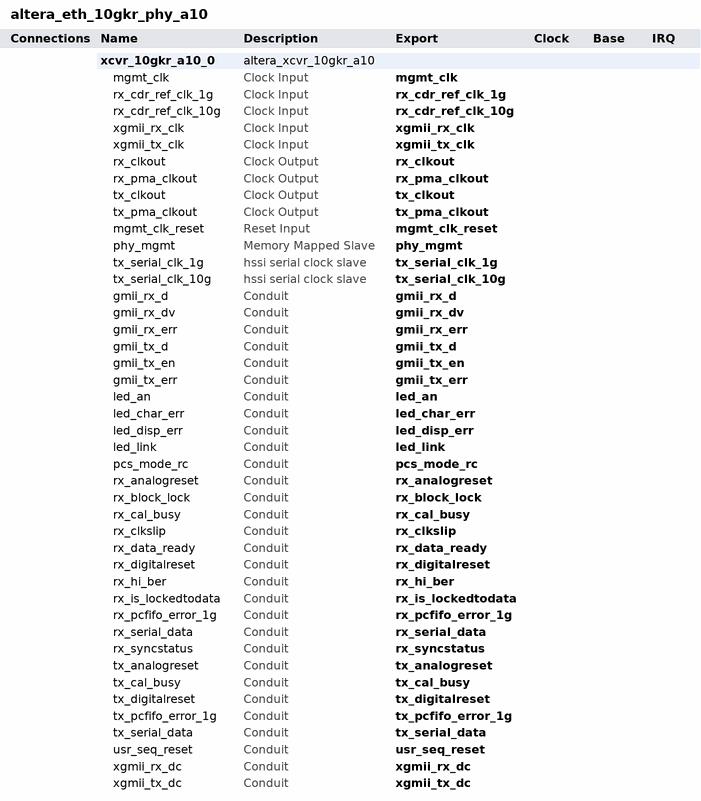
[diagram p0: system contents]
# Platform Designer (Qsys) system altera_eth_10gkr_phy_a10, Arria 10 10AX115S4F45I3SGE2
# Parameters at their usual value, and those the tool derives, are not listed.
package require -exact qsys 16.0
create_system altera_eth_10gkr_phy_a10
set_project_property DEVICE_FAMILY {Arria 10}
set_project_property DEVICE 10AX115S4F45I3SGE2

add_instance xcvr_10gkr_a10_0 altera_xcvr_10gkr_a10 16.0
set_instance_property xcvr_10gkr_a10_0 AUTO_EXPORT true
set_instance_parameter_value xcvr_10gkr_a10_0 AN_100G 0
set_instance_parameter_value xcvr_10gkr_a10_0 AN_40GBP 0
set_instance_parameter_value xcvr_10gkr_a10_0 AN_40GCR 0
set_instance_parameter_value xcvr_10gkr_a10_0 AN_BASER 1
set_instance_parameter_value xcvr_10gkr_a10_0 AN_FEC 0
set_instance_parameter_value xcvr_10gkr_a10_0 AN_PAUSE_C0 1
set_instance_parameter_value xcvr_10gkr_a10_0 AN_PAUSE_C1 1
set_instance_parameter_value xcvr_10gkr_a10_0 AN_SELECTOR 1
set_instance_parameter_value xcvr_10gkr_a10_0 AN_XAUI 0
set_instance_parameter_value xcvr_10gkr_a10_0 BERWIDTH_gui 511
set_instance_parameter_value xcvr_10gkr_a10_0 CAPABLE_FEC 1
set_instance_parameter_value xcvr_10gkr_a10_0 DEV_VERSION 0
set_instance_parameter_value xcvr_10gkr_a10_0 ENABLE_FEC 1
set_instance_parameter_value xcvr_10gkr_a10_0 ENABLE_PCS_MODE 1
set_instance_parameter_value xcvr_10gkr_a10_0 EN_CORECLK_1G 0
set_instance_parameter_value xcvr_10gkr_a10_0 ERR_INDICATION 1
set_instance_parameter_value xcvr_10gkr_a10_0 GOOD_PARITY 4
set_instance_parameter_value xcvr_10gkr_a10_0 HARD_PRBS_ENABLE 0
set_instance_parameter_value xcvr_10gkr_a10_0 HARD_PRBS_ENABLE_PORT 0
set_instance_parameter_value xcvr_10gkr_a10_0 INITMAINVAL 25
set_instance_parameter_value xcvr_10gkr_a10_0 INITPOSTVAL 22
set_instance_parameter_value xcvr_10gkr_a10_0 INITPREVAL 3
set_instance_parameter_value xcvr_10gkr_a10_0 INI_DATAPATH 10G
set_instance_parameter_value xcvr_10gkr_a10_0 INVALD_PARITY 8
set_instance_parameter_value xcvr_10gkr_a10_0 LINK_TIMER_KR 504.00
set_instance_parameter_value xcvr_10gkr_a10_0 LINK_TIMER_KX 48.00
set_instance_parameter_value xcvr_10gkr_a10_0 OPTIONAL_10G 1
set_instance_parameter_value xcvr_10gkr_a10_0 OPTIONAL_FEC 0
set_instance_parameter_value xcvr_10gkr_a10_0 OPTIONAL_RXPMA_CLK 1
set_instance_parameter_value xcvr_10gkr_a10_0 OPTIONAL_RX_CLKOUT 1
set_instance_parameter_value xcvr_10gkr_a10_0 OPTIONAL_RX_DIV33CLK 0
set_instance_parameter_value xcvr_10gkr_a10_0 OPTIONAL_TXPMA_CLK 1
set_instance_parameter_value xcvr_10gkr_a10_0 OPTIONAL_TX_CLKOUT 1
set_instance_parameter_value xcvr_10gkr_a10_0 OPTIONAL_TX_DIV33CLK 0
set_instance_parameter_value xcvr_10gkr_a10_0 PHY_IDENTIFIER 0
set_instance_parameter_value xcvr_10gkr_a10_0 PREMAINVAL 30
set_instance_parameter_value xcvr_10gkr_a10_0 PREPOSTVAL 0
set_instance_parameter_value xcvr_10gkr_a10_0 PREPREVAL 0
set_instance_parameter_value xcvr_10gkr_a10_0 REF_CLK_FREQ_10G 644.53125
set_instance_parameter_value xcvr_10gkr_a10_0 REF_CLK_FREQ_1G {125.00 MHz}
set_instance_parameter_value xcvr_10gkr_a10_0 SYNTH_1588_ALL 0
set_instance_parameter_value xcvr_10gkr_a10_0 SYNTH_AN 0
set_instance_parameter_value xcvr_10gkr_a10_0 SYNTH_FEC 0
set_instance_parameter_value xcvr_10gkr_a10_0 SYNTH_GIGE 1
set_instance_parameter_value xcvr_10gkr_a10_0 SYNTH_GMII_gui 1
set_instance_parameter_value xcvr_10gkr_a10_0 SYNTH_LT 0
set_instance_parameter_value xcvr_10gkr_a10_0 SYNTH_MII 0
set_instance_parameter_value xcvr_10gkr_a10_0 SYNTH_RCFG 1
set_instance_parameter_value xcvr_10gkr_a10_0 SYNTH_SEQ 1
set_instance_parameter_value xcvr_10gkr_a10_0 SYNTH_SGMII 1
set_instance_parameter_value xcvr_10gkr_a10_0 TRNWTWIDTH_gui 127
set_instance_parameter_value xcvr_10gkr_a10_0 USE_DEBUG_CPU 0
set_instance_parameter_value xcvr_10gkr_a10_0 USE_ECC_CPU 0
set_instance_parameter_value xcvr_10gkr_a10_0 VMAXRULE 30
set_instance_parameter_value xcvr_10gkr_a10_0 VMINRULE 6
set_instance_parameter_value xcvr_10gkr_a10_0 VODMINRULE 14
set_instance_parameter_value xcvr_10gkr_a10_0 VPOSTRULE 25
set_instance_parameter_value xcvr_10gkr_a10_0 VPRERULE 16
set_instance_parameter_value xcvr_10gkr_a10_0 XGMII_32BIT_MODE 0
set_instance_parameter_value xcvr_10gkr_a10_0 phy_mgmt_clk_freq 125
set_instance_parameter_value xcvr_10gkr_a10_0 sel_backplane_lineside {1Gb/10Gb Ethernet}

# exported interfaces
add_interface gmii_rx_d conduit end
set_interface_property gmii_rx_d EXPORT_OF xcvr_10gkr_a10_0.gmii_rx_d
add_interface gmii_rx_dv conduit end
set_interface_property gmii_rx_dv EXPORT_OF xcvr_10gkr_a10_0.gmii_rx_dv
add_interface gmii_rx_err conduit end
set_interface_property gmii_rx_err EXPORT_OF xcvr_10gkr_a10_0.gmii_rx_err
add_interface gmii_tx_d conduit end
set_interface_property gmii_tx_d EXPORT_OF xcvr_10gkr_a10_0.gmii_tx_d
add_interface gmii_tx_en conduit end
set_interface_property gmii_tx_en EXPORT_OF xcvr_10gkr_a10_0.gmii_tx_en
add_interface gmii_tx_err conduit end
set_interface_property gmii_tx_err EXPORT_OF xcvr_10gkr_a10_0.gmii_tx_err
add_interface led_an conduit end
set_interface_property led_an EXPORT_OF xcvr_10gkr_a10_0.led_an
add_interface led_char_err conduit end
set_interface_property led_char_err EXPORT_OF xcvr_10gkr_a10_0.led_char_err
add_interface led_disp_err conduit end
set_interface_property led_disp_err EXPORT_OF xcvr_10gkr_a10_0.led_disp_err
add_interface led_link conduit end
set_interface_property led_link EXPORT_OF xcvr_10gkr_a10_0.led_link
add_interface mgmt_clk clock sink
set_interface_property mgmt_clk EXPORT_OF xcvr_10gkr_a10_0.mgmt_clk
add_interface mgmt_clk_reset reset sink
set_interface_property mgmt_clk_reset EXPORT_OF xcvr_10gkr_a10_0.mgmt_clk_reset
add_interface pcs_mode_rc conduit end
set_interface_property pcs_mode_rc EXPORT_OF xcvr_10gkr_a10_0.pcs_mode_rc
add_interface phy_mgmt avalon slave
set_interface_property phy_mgmt EXPORT_OF xcvr_10gkr_a10_0.phy_mgmt
add_interface rx_analogreset conduit end
set_interface_property rx_analogreset EXPORT_OF xcvr_10gkr_a10_0.rx_analogreset
add_interface rx_block_lock conduit end
set_interface_property rx_block_lock EXPORT_OF xcvr_10gkr_a10_0.rx_block_lock
add_interface rx_cal_busy conduit end
set_interface_property rx_cal_busy EXPORT_OF xcvr_10gkr_a10_0.rx_cal_busy
add_interface rx_cdr_ref_clk_10g clock sink
set_interface_property rx_cdr_ref_clk_10g EXPORT_OF xcvr_10gkr_a10_0.rx_cdr_ref_clk_10g
add_interface rx_cdr_ref_clk_1g clock sink
set_interface_property rx_cdr_ref_clk_1g EXPORT_OF xcvr_10gkr_a10_0.rx_cdr_ref_clk_1g
add_interface rx_clkout clock source
set_interface_property rx_clkout EXPORT_OF xcvr_10gkr_a10_0.rx_clkout
add_interface rx_clkslip conduit end
set_interface_property rx_clkslip EXPORT_OF xcvr_10gkr_a10_0.rx_clkslip
add_interface rx_data_ready conduit end
set_interface_property rx_data_ready EXPORT_OF xcvr_10gkr_a10_0.rx_data_ready
add_interface rx_digitalreset conduit end
set_interface_property rx_digitalreset EXPORT_OF xcvr_10gkr_a10_0.rx_digitalreset
add_interface rx_hi_ber conduit end
set_interface_property rx_hi_ber EXPORT_OF xcvr_10gkr_a10_0.rx_hi_ber
add_interface rx_is_lockedtodata conduit end
set_interface_property rx_is_lockedtodata EXPORT_OF xcvr_10gkr_a10_0.rx_is_lockedtodata
add_interface rx_pcfifo_error_1g conduit end
set_interface_property rx_pcfifo_error_1g EXPORT_OF xcvr_10gkr_a10_0.rx_pcfifo_error_1g
add_interface rx_pma_clkout clock source
set_interface_property rx_pma_clkout EXPORT_OF xcvr_10gkr_a10_0.rx_pma_clkout
add_interface rx_serial_data conduit end
set_interface_property rx_serial_data EXPORT_OF xcvr_10gkr_a10_0.rx_serial_data
add_interface rx_syncstatus conduit end
set_interface_property rx_syncstatus EXPORT_OF xcvr_10gkr_a10_0.rx_syncstatus
add_interface tx_analogreset conduit end
set_interface_property tx_analogreset EXPORT_OF xcvr_10gkr_a10_0.tx_analogreset
add_interface tx_cal_busy conduit end
set_interface_property tx_cal_busy EXPORT_OF xcvr_10gkr_a10_0.tx_cal_busy
add_interface tx_clkout clock source
set_interface_property tx_clkout EXPORT_OF xcvr_10gkr_a10_0.tx_clkout
add_interface tx_digitalreset conduit end
set_interface_property tx_digitalreset EXPORT_OF xcvr_10gkr_a10_0.tx_digitalreset
add_interface tx_pcfifo_error_1g conduit end
set_interface_property tx_pcfifo_error_1g EXPORT_OF xcvr_10gkr_a10_0.tx_pcfifo_error_1g
add_interface tx_pma_clkout clock source
set_interface_property tx_pma_clkout EXPORT_OF xcvr_10gkr_a10_0.tx_pma_clkout
add_interface tx_serial_clk_10g hssi_serial_clock end
set_interface_property tx_serial_clk_10g EXPORT_OF xcvr_10gkr_a10_0.tx_serial_clk_10g
add_interface tx_serial_clk_1g hssi_serial_clock end
set_interface_property tx_serial_clk_1g EXPORT_OF xcvr_10gkr_a10_0.tx_serial_clk_1g
add_interface tx_serial_data conduit end
set_interface_property tx_serial_data EXPORT_OF xcvr_10gkr_a10_0.tx_serial_data
add_interface usr_seq_reset conduit end
set_interface_property usr_seq_reset EXPORT_OF xcvr_10gkr_a10_0.usr_seq_reset
add_interface xgmii_rx_clk clock sink
set_interface_property xgmii_rx_clk EXPORT_OF xcvr_10gkr_a10_0.xgmii_rx_clk
add_interface xgmii_rx_dc conduit end
set_interface_property xgmii_rx_dc EXPORT_OF xcvr_10gkr_a10_0.xgmii_rx_dc
add_interface xgmii_tx_clk clock sink
set_interface_property xgmii_tx_clk EXPORT_OF xcvr_10gkr_a10_0.xgmii_tx_clk
add_interface xgmii_tx_dc conduit end
set_interface_property xgmii_tx_dc EXPORT_OF xcvr_10gkr_a10_0.xgmii_tx_dc

set_interconnect_requirement {$system} qsys_mm.clockCrossingAdapter HANDSHAKE
set_interconnect_requirement {$system} qsys_mm.insertDefaultSlave FALSE
set_interconnect_requirement {$system} qsys_mm.maxAdditionalLatency 1

save_system altera_eth_10gkr_phy_a10.qsys
